# EAGLE design socket_to_header_with_driver (EAGLE 9.6.2)
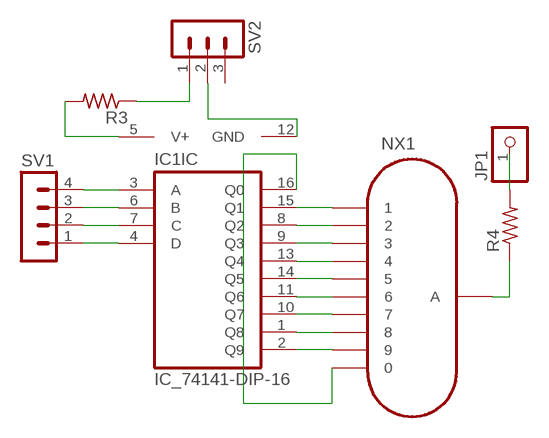
[diagram p0: schematic, sheet 1]

## Parts
IC1  IC_74141-DIP-16  [DIL16]
JP1  PINHD-1X1  [1X01]
NX1  IN-12A  [IN-12]
R3  R-US_0204/7  [0204/7]
R4  R-US_0204/7  [0204/7]
SV1  MA04-1  [MA04-1]
SV2  MA03-1  [MA03-1]

## Nets
GND: IC1.12(SUPPLY:GND) SV2.2
N$1: IC1.2(IC:Q9) NX1.9
N$2: IC1.1(IC:Q8) NX1.8
N$3: IC1.10(IC:Q7) NX1.7
N$4: IC1.11(IC:Q6) NX1.6
N$5: IC1.14(IC:Q5) NX1.5
N$6: IC1.13(IC:Q4) NX1.4
N$7: IC1.9(IC:Q3) NX1.3
N$8: IC1.8(IC:Q2) NX1.2
N$9: IC1.15(IC:Q1) NX1.1
N$10: IC1.16(IC:Q0) NX1.0
N$11: NX1.A R4.1
N$12: JP1.1 R4.2
N$13: IC1.4(IC:D) SV1.1
N$14: IC1.7(IC:C) SV1.2
N$15: IC1.6(IC:B) SV1.3
N$16: IC1.3(IC:A) SV1.4
N$17: R3.1 SV2.1
V+: IC1.5(SUPPLY:V+) R3.2
Unconnected: SV2.3

## Library data of the parts
IC1 = dp_devices:IC_74141: BCD to decimal decoder
JP1 = pinhead:PINHD-1X1: PIN HEADER
NX1 = nixies-us:IN-12A: IN-12A: medium numeric topview nixie tube
R3 R4 = rcl:R-US_: RESISTOR, American symbol; SPICEPREFIX: R
SV1 = con-lstb:MA04-1: PIN HEADER; OC_FARNELL: unknown; OC_NEWARK: unknown
SV2 = con-lstb:MA03-1: PIN HEADER; OC_FARNELL: unknown; OC_NEWARK: unknown

## Board
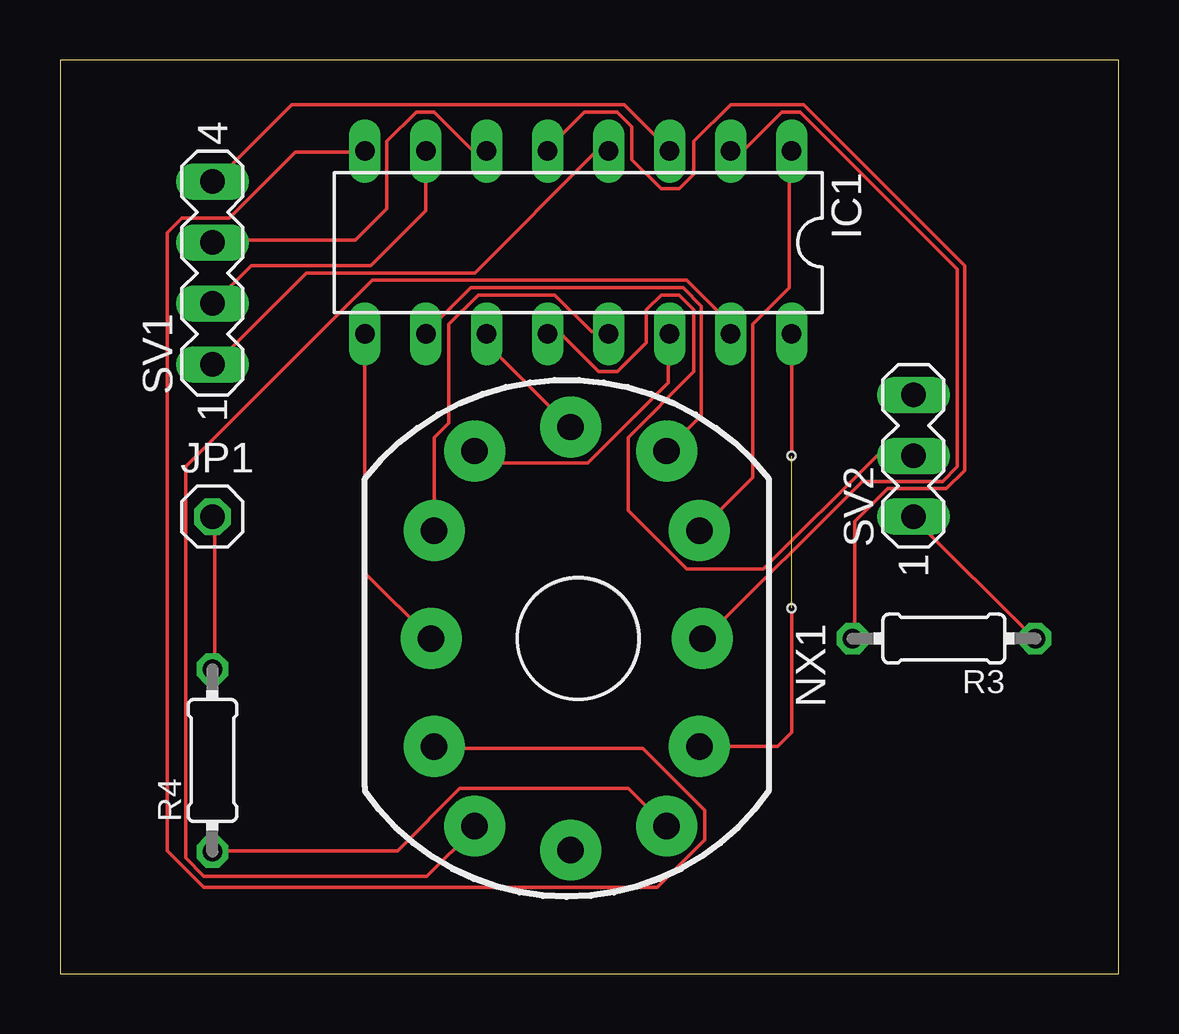
[diagram p1: board, top side]

Size 44.12 x 38.09 mm. Coordinates in mm from the lower left corner, seen from the top.
Outline: 0,0 44.12,0 44.12,38.09 0,38.09 0,0
Copper layers (1*16): Top 0.035mm / dielectric 1.5mm / Bottom 0.035mm
Design rules "default": minimum track width 6mil, minimum drill 0.35mm, track to track 6mil, track to pad 6mil, pad to pad 6mil, via to via 6mil, smd to smd 6mil, copper to edge 40mil, drill to drill 6mil, minimum pad ring 10mil, minimum via ring 8mil, stop-mask expansion 4mil, vias tented up to drill 0mil, thermal gap 10mil
Holes 0.35 mm at 30.48,21.59 30.48,15.24

### Footprints (pad centres in the part's own frame; a part is rotated, then mirrored left to right if it is on the bottom)
DIL16 = drill 0.813 long: 1 -8.89,-3.81; 2 -6.35,-3.81; 3 -3.81,-3.81; 4 -1.27,-3.81; 5 1.27,-3.81; 6 3.81,-3.81; 7 6.35,-3.81; 8 8.89,-3.81; 9 8.89,3.81; 10 6.35,3.81; 11 3.81,3.81; 12 1.27,3.81; 13 -1.27,3.81; 14 -3.81,3.81; 15 -6.35,3.81; 16 -8.89,3.81
1X01 = drill 1.016 octagon: 1 0,0
IN-12 = drill 1.1 pad 2.54: 0 5.048,-4.5; 1 -4.317,-7.817; 2 -6,-4.5; 3 -6.127,0; 4 -6,4.5; 5 -4.317,7.817; 6 -0.318,8.818; 7 3.683,7.817; 8 5.048,4.5; 9 5.175,0; A 3.683,-7.817; LHDP -0.318,-8.818 | hole 5: 0,0
0204/7 = drill 0.813 octagon: 1 -3.81,0; 2 3.81,0
MA04-1 = drill 1.016 long: 1 -3.81,0; 2 -1.27,0; 3 1.27,0; 4 3.81,0
MA03-1 = drill 1.016 long: 1 -2.54,0; 2 0,0; 3 2.54,0

### Placement (x,y rotation side)
IC1  21.59,30.48 180 top
JP1  6.35,19.05 0 top
NX1  21.59,13.97 0 top
R3  36.83,13.97 180 top
R4  6.35,8.89 90 top
SV1  6.35,29.21 90 top
SV2  35.56,21.59 90 top

### Tracks (layer width: path | path; a pad name or v marks a point on that pad's centre or on a via)
GND
  Top 0.152: SV2.2 34.04,21.59 29.31,16.87 26.11,16.87 23.67,19.3 23.67,22.35 26.42,25.09 26.42,27.69 25.81,28.3 25.04,28.3 24.44,27.69 24.44,26.31 23.22,25.09 22.45,25.09 20.93,26.62 20.32,26.62 IC1.12
N$1
  Top 0.152: IC1.2 27.94,34.39 28.55,34.39 30.07,35.92 30.84,35.92 37.39,29.36 37.39,21.13 36.78,20.52 33.43,20.52 26.87,13.97 NX1.9
N$2
  Top 0.152: IC1.1 30.38,34.24 30.38,28.6 28.85,27.08 28.85,20.68 26.72,18.54 NX1.8
N$3
  Top 0.152: IC1.10 15.29,26.77 17.12,28.6 25.96,28.6 26.72,27.84 26.72,23.27 25.35,21.9 NX1.7
N$4
  Top 0.152: IC1.11 17.88,26.62 17.88,26.16 21.23,22.81 NX1.6
N$5
  Top 0.152: IC1.14 25.35,26.62 25.35,24.64 22,21.28 17.88,21.28 17.42,21.74 NX1.5
N$6
  Top 0.152: IC1.13 22.76,26.77 22.15,26.77 20.62,28.3 17.42,28.3 16.2,27.08 16.2,22.96 15.6,22.35 15.6,18.54 NX1.4
N$7
  Top 0.152: IC1.9 12.7,16.71 15.44,13.97 NX1.3
N$8
  Top 0.152: IC1.8 12.7,34.24 9.8,34.24 7.06,31.5 5.08,31.5 4.47,30.89 4.47,5.13 5.99,3.61 24.89,3.61 26.87,5.59 26.87,6.81 24.28,9.4 15.6,9.4 NX1.2
N$9
  Top 0.152: IC1.15 27.94,27.08 26.11,28.91 13.01,28.91 5.23,21.13 5.23,4.83 5.99,4.06 15.29,4.06 17.27,6.05 NX1.1
N$10  (1 unrouted)
  Top 0.152: IC1.16 30.48,21.59 | NX1.0 29.9,9.47 30.48,10.05 30.48,15.24
N$11
  Top 0.152: R4.1 6.45,5.13 14.07,5.13 16.66,7.72 23.67,7.72 25.2,6.2 NX1.A
N$12
  Top 0.152: R4.2 6.45,12.75 6.45,19 JP1.1
N$13
  Top 0.152: IC1.4 22.76,34.24 22.3,34.24 17.27,29.21 10.26,29.21 6.45,25.4 SV1.1
N$14
  Top 0.152: IC1.7 15.24,31.8 12.95,29.52 7.98,29.52 6.45,27.99 SV1.2
N$15
  Top 0.152: IC1.6 17.73,34.39 17.12,34.39 15.6,35.92 14.83,35.92 13.61,34.7 13.61,31.9 12.29,30.58 6.45,30.58 SV1.3
N$16
  Top 0.152: IC1.3 25.35,34.39 23.52,36.22 9.65,36.22 6.45,33.02 SV1.4
N$17
  Top 0.152: R3.1 40.59,13.97 35.56,19 SV2.1
V+
  Top 0.152: R3.2 33.12,13.97 33.12,18.85 34.49,20.22 36.93,20.22 37.69,20.98 37.69,29.52 30.99,36.22 27.94,36.22 26.42,34.7 26.42,33.33 25.81,32.72 25.04,32.72 23.83,33.93 23.83,35.31 23.22,35.92 21.84,35.92 20.32,34.39 IC1.5